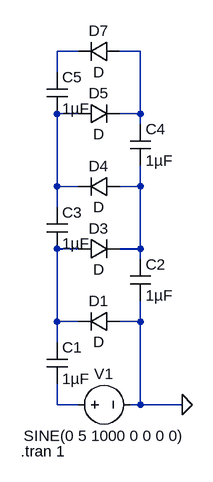
[diagram p0: schematic CockcroftWaltonCircuit.asc]
CockcroftWaltonCircuit.asc, the LTspice schematic file:
Version 4
SHEET 1 880 680
WIRE 16 -304 -16 -304
WIRE 112 -304 80 -304
WIRE -16 -272 -16 -304
WIRE 16 -208 -16 -208
WIRE 112 -208 112 -304
WIRE 112 -208 80 -208
WIRE 112 -192 112 -208
WIRE -16 -96 -16 -208
WIRE 16 -96 -16 -96
WIRE 112 -96 112 -128
WIRE 112 -96 80 -96
WIRE -16 -64 -16 -96
WIRE 16 0 -16 0
WIRE 112 0 112 -96
WIRE 112 0 80 0
WIRE 112 16 112 0
WIRE -16 112 -16 0
WIRE 16 112 -16 112
WIRE 112 112 112 80
WIRE 112 112 80 112
WIRE -16 144 -16 112
WIRE -16 240 -16 208
WIRE 16 240 -16 240
WIRE 112 240 112 112
WIRE 112 240 96 240
WIRE 176 240 112 240
FLAG 176 240 0
SYMBOL diode 80 96 R90
WINDOW 0 0 32 VBottom 2
WINDOW 3 32 32 VTop 2
SYMATTR InstName D1
SYMBOL voltage 0 240 R270
WINDOW 0 32 56 VTop 2
WINDOW 3 -32 56 VBottom 2
WINDOW 123 0 0 Left 2
WINDOW 39 0 0 Left 2
SYMATTR InstName V1
SYMATTR Value SINE(0 5 1000 0 0 0 0)
SYMBOL cap -32 144 R0
SYMATTR InstName C1
SYMATTR Value 1µF
SYMBOL cap 96 16 R0
SYMATTR InstName C2
SYMATTR Value 1µF
SYMBOL diode 16 -16 M90
WINDOW 0 0 32 VBottom 2
WINDOW 3 32 32 VTop 2
SYMATTR InstName D3
SYMBOL diode 80 -112 R90
WINDOW 0 0 32 VBottom 2
WINDOW 3 32 32 VTop 2
SYMATTR InstName D4
SYMBOL cap -32 -64 R0
SYMATTR InstName C3
SYMATTR Value 1µF
SYMBOL cap 96 -192 R0
SYMATTR InstName C4
SYMATTR Value 1µF
SYMBOL diode 16 -224 M90
WINDOW 0 0 32 VBottom 2
WINDOW 3 32 32 VTop 2
SYMATTR InstName D5
SYMBOL diode 80 -320 R90
WINDOW 0 0 32 VBottom 2
WINDOW 3 32 32 VTop 2
SYMATTR InstName D7
SYMBOL cap -32 -272 R0
SYMATTR InstName C5
SYMATTR Value 1µF
TEXT -72 312 Left 2 !.tran 1

The netlist it stands for:
* CockcroftWaltonCircuit.asc
D1 0 N005 D
V1 N006 0 SINE(0 5 1000 0 0 0 0)
C1 N005 N006 1µF
C2 N004 0 1µF
D3 N005 N004 D
D4 N004 N003 D
C3 N003 N005 1µF
C4 N002 N004 1µF
D5 N003 N002 D
D7 N002 N001 D
C5 N001 N003 1µF
.model D D
.lib standard.dio
.tran 1
.backanno
.end